# Altium project MyRC.PrjPCB
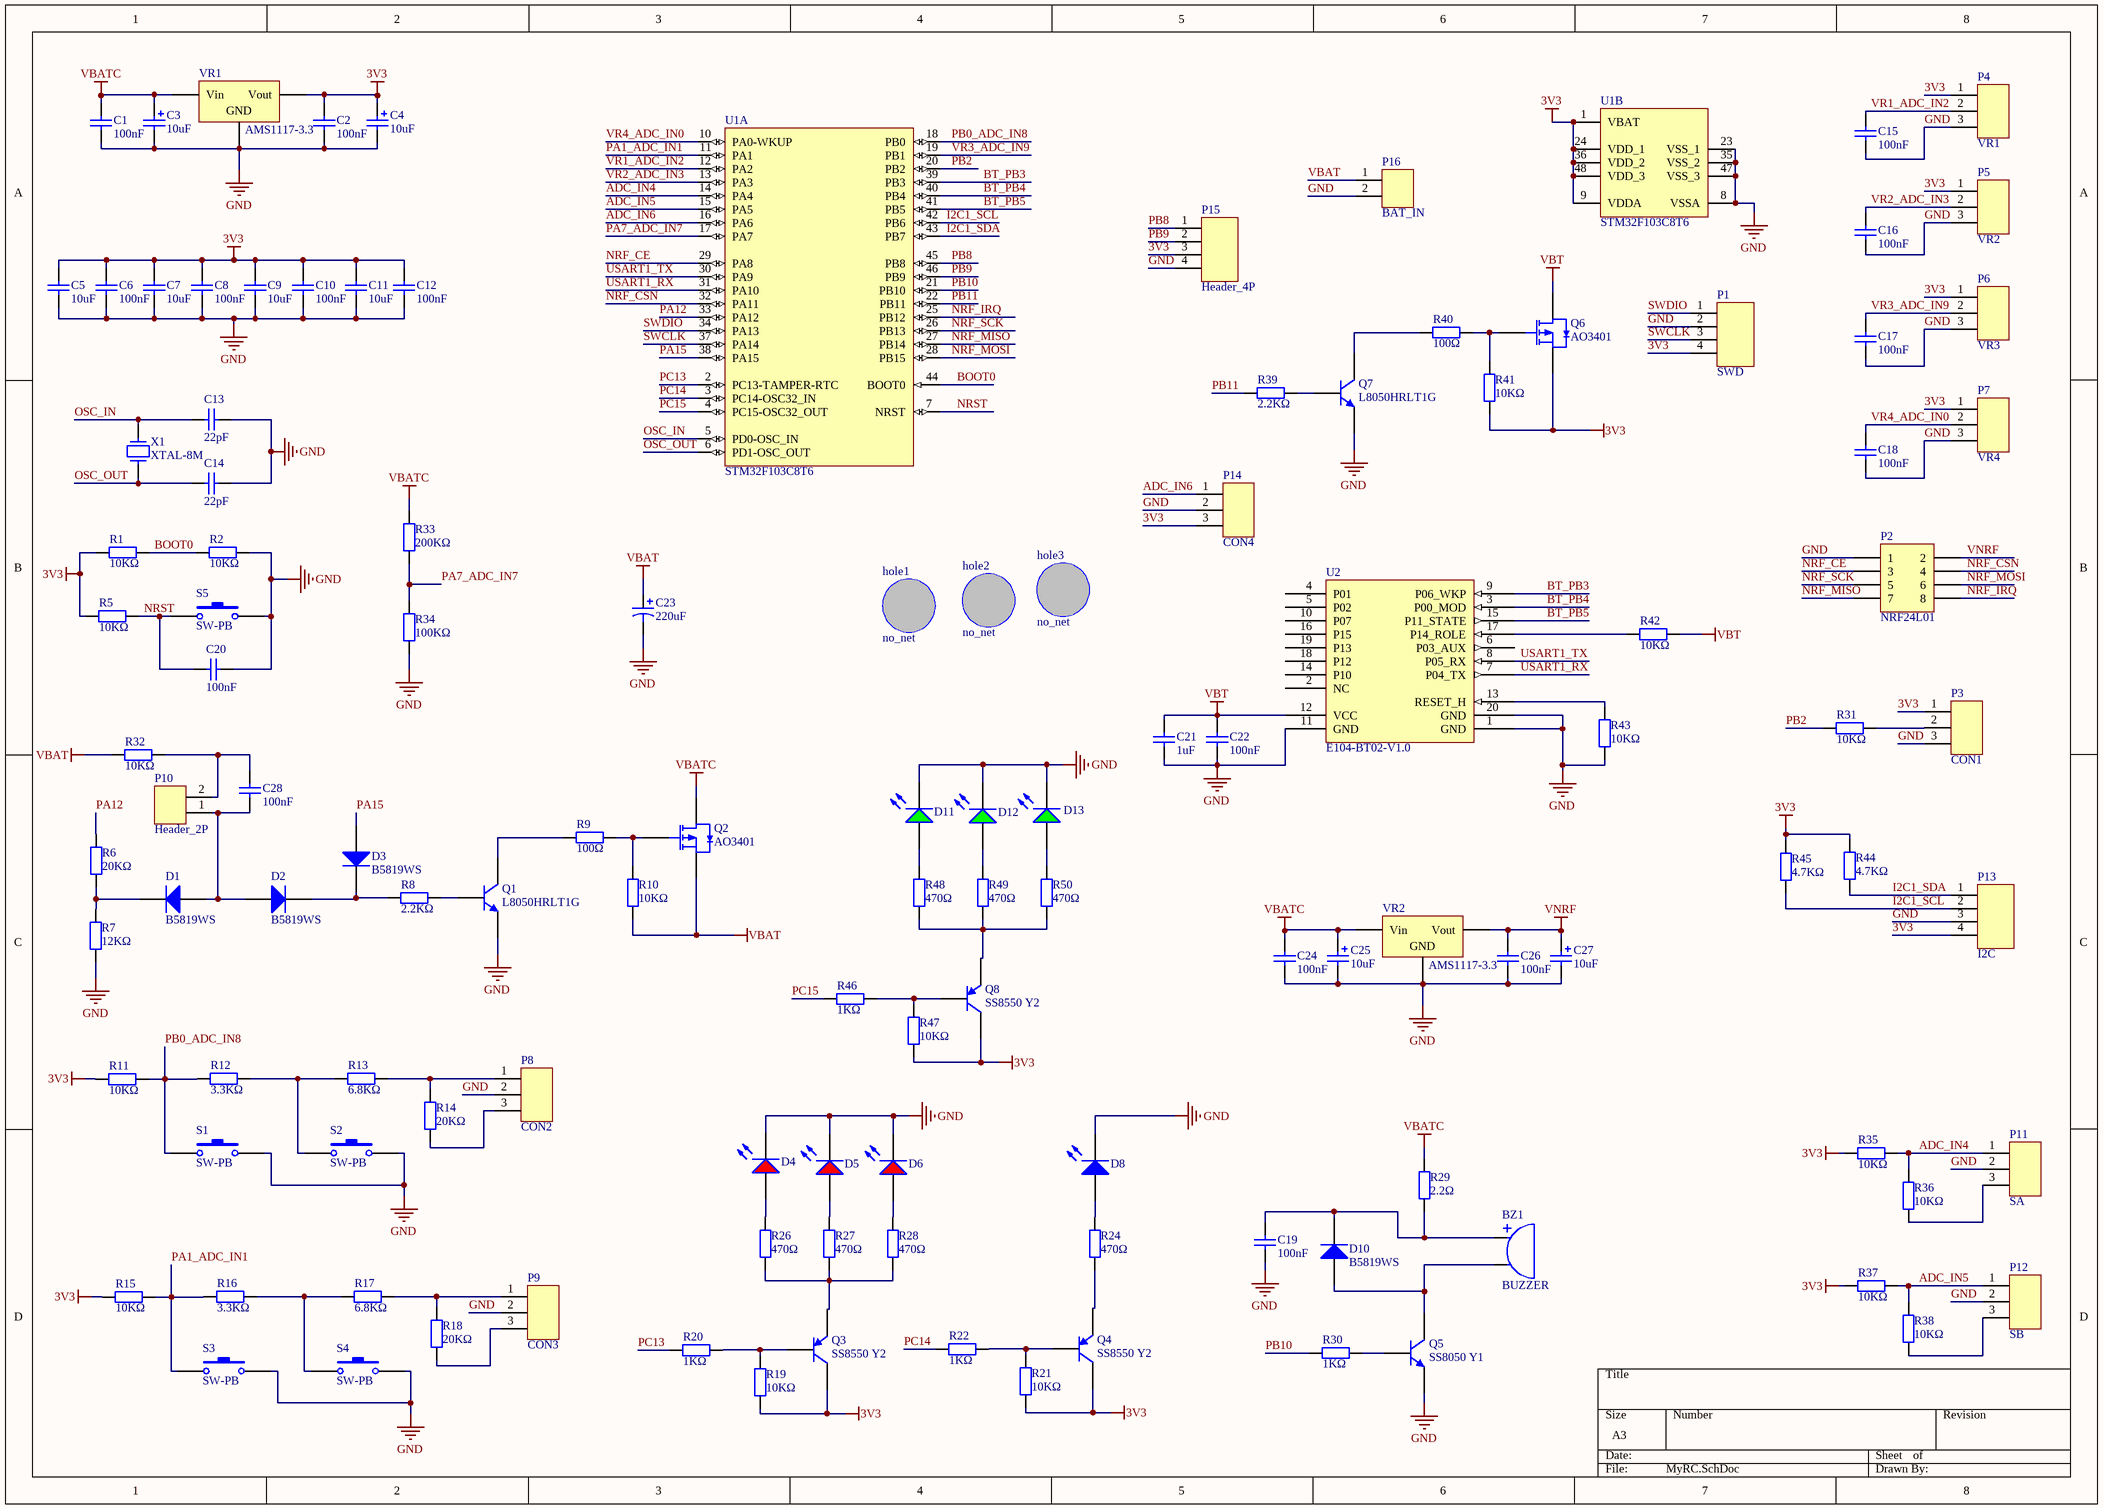
[diagram p0: MyRC.SchDoc]
1 sheet, 123 parts. Net scope: global (net labels, ports and power ports of the same name join across sheets).
Board file: MyRC.PcbDoc

## Sheet MyRC.SchDoc
size A3

### Parts
BZ1  BUZZER  [BUZ_9MM]
C1  100nF  [0603_C]
C2  100nF  [0603_C]
C3  10uF  [CASE-A_3216]
C4  10uF  [CASE-A_3216]
C5  10uF  [0603_C]
C6  100nF  [0603_C]
C7  10uF  [0603_C]
C8  100nF  [0603_C]
C9  10uF  [0603_C]
C10  100nF  [0603_C]
C11  10uF  [0603_C]
C12  100nF  [0603_C]
C13  22pF  [0603_C]
C14  22pF  [0603_C]
C15  100nF  [0603_C]
C16  100nF  [0603_C]
C17  100nF  [0603_C]
C18  100nF  [0603_C]
C19  100nF  [0603_C]
C20  100nF  [0603_C]
C21  1uF  [0603_C]
C22  100nF  [0603_C]
C23  value 220uF  [SMD_220uF]  (hidden comment: Cap Pol3)
C24  100nF  [0603_C]
C25  10uF  [CASE-A_3216]
C26  100nF  [0603_C]
C27  10uF  [CASE-A_3216]
C28  100nF  [0603_C]
D1  B5819WS  [SOD-323]
D2  B5819WS  [SOD-323]
D3  B5819WS  [SOD-323]
D4  红灯 0603  [0603_LED_S1]  (value not drawn)
D5  红灯 0603  [0603_LED_S1]  (value not drawn)
D6  红灯 0603  [0603_LED_S1]  (value not drawn)
D8  蓝灯 0603  [0603_LED_S1]  (value not drawn)
D10  B5819WS  [SOD-323]
D11  绿灯 0603  [0603_LED_S1]  (value not drawn)
D12  绿灯 0603  [0603_LED_S1]  (value not drawn)
D13  绿灯 0603  [0603_LED_S1]  (value not drawn)
hole1  no_net  [Screw_holes]
hole2  no_net  [Screw_holes]
hole3  no_net  [Screw_holes]
P1  SWD  [SMD_1.25T_4P]
P2  NRF24L01  [HDR2X4]
P3  CON1  [SMD_1.25T_3P]
P4  VR1  [SMD_1.25T_3P]
P5  VR2  [SMD_1.25T_3P]
P6  VR3  [SMD_1.25T_3P]
P7  VR4  [SMD_1.25T_3P]
P8  CON2  [SMD_1.25T_3P]
P9  CON3  [SMD_1.25T_3P]
P10  Header_2P  [SMD_1.25T_2P]
P11  SA  [SMD_1.25T_3P]
P12  SB  [SMD_1.25T_3P]
P13  I2C  [SMD_1.25T_4P]
P14  CON4  [SMD_1.25T_3P]
P15  Header_4P  [SMD_1.25T_4P]
P16  BAT_IN  [BAT_IN]
Q1  L8050HRLT1G  [SOT-23(SOT-23-3)]
Q2  AO3401  [SOT-23-3L]
Q3  SS8550 Y2  [SOT-23(SOT-23-3)]
Q4  SS8550 Y2  [SOT-23(SOT-23-3)]
Q5  SS8050 Y1  [SOT-23(SOT-23-3)]
Q6  AO3401  [SOT-23-3L]
Q7  L8050HRLT1G  [SOT-23(SOT-23-3)]
Q8  SS8550 Y2  [SOT-23(SOT-23-3)]
R1  10KΩ  [0603_R]
R2  10KΩ  [0603_R]
R5  10KΩ  [0603_R]
R6  20KΩ  [0603_R]
R7  12KΩ  [0603_R]
R8  2.2KΩ  [0603_R]
R9  100Ω  [0603_R]
R10  10KΩ  [0603_R]
R11  10KΩ  [0603_R]
R12  3.3KΩ  [0603_R]
R13  6.8KΩ  [0603_R]
R14  20KΩ  [0603_R]
R15  10KΩ  [0603_R]
R16  3.3KΩ  [0603_R]
R17  6.8KΩ  [0603_R]
R18  20KΩ  [0603_R]
R19  10KΩ  [0603_R]
R20  1KΩ  [0603_R]
R21  10KΩ  [0603_R]
R22  1KΩ  [0603_R]
R24  470Ω  [0603_R]
R26  470Ω  [0603_R]
R27  470Ω  [0603_R]
R28  470Ω  [0603_R]
R29  2.2Ω  [0603_R]
R30  1KΩ  [0603_R]
R31  10KΩ  [0603_R]
R32  10KΩ  [0603_R]
R33  200KΩ  [0603_R]
R34  100KΩ  [0603_R]
R35  10KΩ  [0603_R]
R36  10KΩ  [0603_R]
R37  10KΩ  [0603_R]
R38  10KΩ  [0603_R]
R39  2.2KΩ  [0603_R]
R40  100Ω  [0603_R]
R41  10KΩ  [0603_R]
R42  10KΩ  [0603_R]
R43  10KΩ  [0603_R]
R44  4.7KΩ  [0603_R]
R45  4.7KΩ  [0603_R]
R46  1KΩ  [0603_R]
R47  10KΩ  [0603_R]
R48  470Ω  [0603_R]
R49  470Ω  [0603_R]
R50  470Ω  [0603_R]
S1  SW-PB  [SMD_KEY_6MM]
S2  SW-PB  [SMD_KEY_6MM]
S3  SW-PB  [SMD_KEY_6MM]
S4  SW-PB  [SMD_KEY_6MM]
S5  SW-PB  [SMD_KEY_4P]
U1  STM32F103C8T6  [STM-LQFP48_N]  (parts A,B of 2)
U2  E104-BT02-V1.0  [PE104-BT02]
VR1  AMS1117-3.3  [SOT-223]
VR2  AMS1117-3.3  [SOT-223]
X1  XTAL-8M  [XTAL_N]

### Nets
3V3: C2.2 C4.1 C5.2 C6.2 C7.2 C8.2 C9.2 C10.2 C11.2 C12.2 P1.4 P3.1 P4.1 P5.1 P6.1 P7.1 P13.4 P14.3 P15.3 Q3.3(C) Q4.3(C) Q6.2(S) Q8.3(C) R1.1 R5.1 R11.2 R15.2 R19.1 R21.1 R35.2 R37.2 R41.1 R44.2 R45.2 R47.1 U1.1(VBAT) U1.9(VDDA) U1.24(VDD_1) U1.36(VDD_2) U1.48(VDD_3) VR1.2(Vout)
GND: C1.1 C2.1 C3.2 C4.2 C5.1 C6.1 C7.1 C8.1 C9.1 C10.1 C11.1 C12.1 C13.2 C14.2 C15.1 C16.1 C17.1 C18.1 C19.1 C20.1 C21.1 C22.1 C23.2 C24.1 C25.2 C26.1 C27.2 D4.K D5.K D6.K D8.K D11.K D12.K D13.K P1.2 P2.1 P3.3 P4.3 P5.3 P6.3 P7.3 P8.2 P9.2 P11.2 P12.2 P13.3 P14.2 P15.4 P16.2 Q1.2(E) Q5.2(E) Q7.2(E) R2.2 R7.2 R34.1 R43.2 S1.2 S2.2 S3.2 S4.2 S5.2 U1.8(VSSA) U1.23(VSS_1) U1.35(VSS_2) U1.47(VSS_3) U2.1(GND) U2.11(GND) U2.20(GND) VR1.1(GND) VR2.1(GND)
VBAT: C23.1 P16.1 Q2.2(S) R10.1 R32.2
VBATC: C1.2 C3.1 C24.2 C25.1 Q2.3(D) R29.2 R33.2 VR1.3(Vin) VR2.3(Vin)
VBT: C21.2 C22.2 Q6.3(D) R42.1 U2.12(VCC)
VNRF: C26.2 C27.1 P2.2 VR2.2(Vout)
ADC_IN4: P11.1 R35.1 R36.1 U1.14(PA4)
ADC_IN5: P12.1 R37.1 R38.1 U1.15(PA5)
ADC_IN6: P14.1 U1.16(PA6)
BOOT0: R1.2 R2.1 U1.44(BOOT0)
BT_PB3: U1.39(PB3) U2.9(P06_WKP)
BT_PB4: U1.40(PB4) U2.3(P00_MOD)
BT_PB5: U1.41(PB5) U2.15(P11_STATE)
I2C1_SCL: P13.2 R45.1 U1.42(PB6)
I2C1_SDA: P13.1 R44.1 U1.43(PB7)
NRF_CE: P2.3 U1.29(PA8)
NRF_CSN: P2.4 U1.32(PA11)
NRF_IRQ: P2.8 U1.25(PB12)
NRF_MISO: P2.7 U1.27(PB14)
NRF_MOSI: P2.6 U1.28(PB15)
NRF_SCK: P2.5 U1.26(PB13)
NRST: C20.2 R5.2 S5.1 U1.7(NRST)
OSC_IN: C13.1 U1.5(PD0-OSC_IN) X1.1
OSC_OUT: C14.1 U1.6(PD1-OSC_OUT) X1.2
PA1_ADC_IN1: R15.1 R16.2 S3.1 U1.11(PA1)
PA7_ADC_IN7: R33.1 R34.2 U1.17(PA7)
PA12: R6.2 U1.33(PA12)
PA15: D3.1(A) U1.38(PA15)
PB0_ADC_IN8: R11.1 R12.2 S1.1 U1.18(PB0)
PB2: R31.2 U1.20(PB2)
PB8: P15.1 U1.45(PB8)
PB9: P15.2 U1.46(PB9)
PB10: R30.2 U1.21(PB10)
PB11: R39.1 U1.22(PB11)
PC13: R20.2 U1.2(PC13-TAMPER-RTC)
PC14: R22.2 U1.3(PC14-OSC32_IN)
PC15: R46.2 U1.4(PC15-OSC32_OUT)
SWCLK: P1.3 U1.37(PA14)
SWDIO: P1.1 U1.34(PA13)
USART1_RX: U1.31(PA10) U2.7(P04_TX)
USART1_TX: U1.30(PA9) U2.8(P05_RX)
VR1_ADC_IN2: C15.2 P4.2 U1.12(PA2)
VR2_ADC_IN3: C16.2 P5.2 U1.13(PA3)
VR3_ADC_IN9: C17.2 P6.2 U1.19(PB1)
VR4_ADC_IN0: C18.2 P7.2 U1.10(PA0-WKUP)
NetBZ1_1: BZ1.1 C19.2 D10.2(K) R29.1
NetBZ1_2: BZ1.2 D10.1(A) Q5.3(C)
NetC28_1: C28.1 D1.1(A) D2.1(A) P10.1
NetC28_2: C28.2 P10.2 R32.1
NetD1_2: D1.2(K) R6.1 R7.1
NetD2_2: D2.2(K) D3.2(K) R8.1
NetD4_A: D4.A R26.2
NetD5_A: D5.A R27.2
NetD6_A: D6.A R28.2
NetD8_A: D8.A R24.2
NetD11_A: D11.A R48.2
NetD12_A: D12.A R49.2
NetD13_A: D13.A R50.2
NetP3_2: P3.2 R31.1
NetP8_1: P8.1 R13.1 R14.1
NetP8_3: P8.3 R14.2
NetP9_1: P9.1 R17.1 R18.1
NetP9_3: P9.3 R18.2
NetP11_3: P11.3 R36.2
NetP12_3: P12.3 R38.2
NetQ1_1: Q1.1(B) R8.2
NetQ1_3: Q1.3(C) R9.2
NetQ2_1: Q2.1(G) R9.1 R10.2
NetQ3_1: Q3.1(B) R19.2 R20.1
NetQ3_2: Q3.2(E) R26.1 R27.1 R28.1
NetQ4_1: Q4.1(B) R21.2 R22.1
NetQ4_2: Q4.2(E) R24.1
NetQ5_1: Q5.1(B) R30.1
NetQ6_1: Q6.1(G) R40.1 R41.2
NetQ7_1: Q7.1(B) R39.2
NetQ7_3: Q7.3(C) R40.2
NetQ8_1: Q8.1(B) R46.1 R47.2
NetQ8_2: Q8.2(E) R48.1 R49.1 R50.1
NetR12_1: R12.1 R13.2 S2.1
NetR16_1: R16.1 R17.2 S4.1
NetR42_2: R42.2 U2.17(P14_ROLE)
NetR43_1: R43.1 U2.13(RESET_H)

Not connected (* = marked no-connect by the designer): U2 2(NC) 4(P01) 5(P02) 6(P03_AUX) 10(P07) 14(P10) 16(P15) 18(P12) 19(P13)

### Library data of the parts
C1 C2 C24 C26 = 0603 220nF (224) 10% 25V: 贴片电容; ComponentLink1Description: 供应商链接; ComponentLink1URL: http://www.szlcsc.com/product/details_21832.html; Package: 0603; Supplier: LC; SuppliersPartNumber: C21120
C3 C4 C25 C27 = 3216 10uF (106) 10% 16V: 钽电容; ComponentLink1Description: 供应商链接; ComponentLink1URL: http://www.szlcsc.com/product/details_7643.html; Package: 3216; Supplier: LC; SuppliersPartNumber: C7171
C5-C12 C15-C22 = 0603 2.2uF (225) 10% 16V: 贴片电容; ComponentLink1Description: 供应商链接; ComponentLink1URL: http://www.szlcsc.com/product/details_24366.html; Package: 0603; Supplier: LC; SuppliersPartNumber: C23630
C13 C14 = 0603 2.2nF (222) 10% 50V: 贴片电容; ComponentLink1Description: 供应商链接; ComponentLink1URL: http://www.szlcsc.com/product/details_1956.html; Package: 0603; Supplier: LC; SuppliersPartNumber: C1604
C23 = Cap Pol3: Polarized Capacitor (Surface Mount); Published: 8-Jun-2000; LatestRevisionDate: 29-May-2009; LatestRevisionNote: IPC-7351 Footprint Added.; PackageReference: C0805; Publisher: Altium Limited; PackageDescription: Chip Capacitor
C28 = 0603 1.2nF (122) 10% 50V: 贴片电容; ComponentLink1Description: 供应商链接; ComponentLink1URL: http://www.szlcsc.com/product/details_31372.html; Package: 0603; Supplier: LC; SuppliersPartNumber: C30615
D1-D3 D10 = SOD-323 1N4148WS T4: 二极管; ComponentLink1Description: 供应商链接; ComponentLink1URL: http://www.szlcsc.com/product/details_2485.html; Package: SOD-323; Supplier: LC; SuppliersPartNumber: C2128
D4-D6 = 0603 红灯: 发光二极管; ComponentLink1Description: 供应商链接; ComponentLink1URL: http://www.szlcsc.com/product/details_2659.html; Package: 0603; Supplier: LC; SuppliersPartNumber: C2286
D8 = 0603 蓝灯: 发光二极管; ComponentLink1Description: 供应商链接; ComponentLink1URL: http://www.szlcsc.com/product/details_73150.html; Package: 0603; Supplier: LC; SuppliersPartNumber: C72041
D11-D13 = 0603 绿灯: 发光二极管; ComponentLink1Description: 供应商链接; ComponentLink1URL: http://www.szlcsc.com/product/details_73152.html; Package: 0603; Supplier: LC; SuppliersPartNumber: C72043
P1 P13 = Header_4P
P2 = Header 4X2: Header, 4-Pin, Dual row; LatestRevisionDate: 17-Jul-2002; LatestRevisionNote: Re-released for DXP Platform.; Publisher: Altium Limited
P3 = Header_3P: 油门微动
P4-P9 P11 P12 P14 = Header_3P
P16 = Header_2P
Q1 Q5 Q7 = SOT-23 SS8050 Y1: 三极管; ComponentLink1Description: 供应商链接; ComponentLink1URL: http://www.szlcsc.com/product/details_2507.html; Package: SOT-23; Supplier: LC; SuppliersPartNumber: C2150
Q2 Q6 = AO3401A P道沟 X13A15 SOT-23: MOS(场效应管); ComponentLink1Description: 供应商链接; ComponentLink1URL: http://www.szlcsc.com/product/details_15801.html; Package: SOT-23; Supplier: LC; SuppliersPartNumber: C15127
Q3 Q4 Q8 = SOT-23 SS8550 Y2: 三极管; ComponentLink1Description: 供应商链接; ComponentLink1URL: http://www.szlcsc.com/product/details_9037.html; Package: SOT-23; Supplier: LC; SuppliersPartNumber: C8542
R1 R2 = 0603 3.6KΩ (3601) 1%: 贴片电阻; ComponentLink1Description: 供应商链接; ComponentLink1URL: http://www.szlcsc.com/product/details_23707.html; Package: 0603; Supplier: LC; SuppliersPartNumber: C22980
R5 = 0603 2KΩ (2001) 1%: 贴片电阻; ComponentLink1Description: 供应商链接; ComponentLink1URL: http://www.szlcsc.com/product/details_23702.html; Package: 0603; Supplier: LC; SuppliersPartNumber: C22975
R6-R10 R31-R34 R39-R45 = 0603 3KΩ (3001) 1%: 贴片电阻; ComponentLink1Description: 供应商链接; ComponentLink1URL: http://www.szlcsc.com/product/details_4618.html; Package: 0603; Supplier: LC; SuppliersPartNumber: C4211
R11-R22 R24 R26-R30 R35-R38 R46-R50 = 0603 1Ω (1R00) 1%: 贴片电阻; ComponentLink1Description: 供应商链接; ComponentLink1URL: http://www.szlcsc.com/product/details_23663.html; Package: 0603; Supplier: LC; SuppliersPartNumber: C22936
S1-S5 = SW-PB: Switch; Published: 24-Mar-1999; LatestRevisionDate: 17-Jul-2002; LatestRevisionNote: Re-released for DXP Platform.; PackageReference: SPST-2; Publisher: Altium Limited; PackageDescription: Switch; 2 Leads
U1 = STM32F103C8T6: ARM Cortex-M3 32-bit MCU, 64 KB Flash, 20 KB Internal RAM, 37 I/Os, 48-pin LQFP, -40 to 85 degC, Tray; A/D Converter: 2x12-bit (10 Channel); FLASH Size (Prog) (kB): 64; I/Os (High Current): 37; Internal RAM Size (kB): 20; Operating Frequency(F) (Processor speed) (MHz): 72; Supply Voltage(Vcc) min (V): 2; DatasheetVersion: Rev. 16; PackageVersion: Rev. 6, 06/2013; PackageReference: LQFP48; PackageDescription: 48-Pin Low Profile Quad Flat Package, 7 x 7 mm Body, 0.5 mm Pitch; Supplier 1: Digi-Key; Supplier Part Number 1: 497-6063-ND; Supplier 2: Farnell; Supplier Part Number 2: 1447637; Supplier 3: Newark; Supplier Part Number 3: 59M2182; Supplier 4: Newark; Supplier Part Number 4: 57P1222; Supplier 5: Mouser; Supplier Part Number 5: 511-STM32F103C8T6; Core: ARM Cortex-M3; Packing: Tray; Mounting Technology: Surface Mount; PartNumber: STM32F103C8T6; ComponentLink1Description: Manufacturer URL; ComponentLink1URL: http://www.st.com/web/en/home.html; ComponentLink2Description: Datasheet; ComponentLink2URL: http://www.st.com/st-web-ui/static/active/en/resource/technical/document/datasheet/CD00161566.pdf; ComponentLink3Description: Package Specification; ComponentLink3URL: http://www.st.com/st-web-ui/static/active/en/resource/technical/document/datasheet/DM00058181.pdf
VR1 VR2 = SOT-223 AMS1117-3.3: 低压差线性稳压(LDO); ComponentLink1Description: 供应商链接; ComponentLink1URL: http://www.szlcsc.com/product/details_6652.html; Package: SOT-223; Supplier: LC; SuppliersPartNumber: C6186
X1 = XTAL-2: Crystal